# EAGLE design untitled (EAGLE 9.6.2)
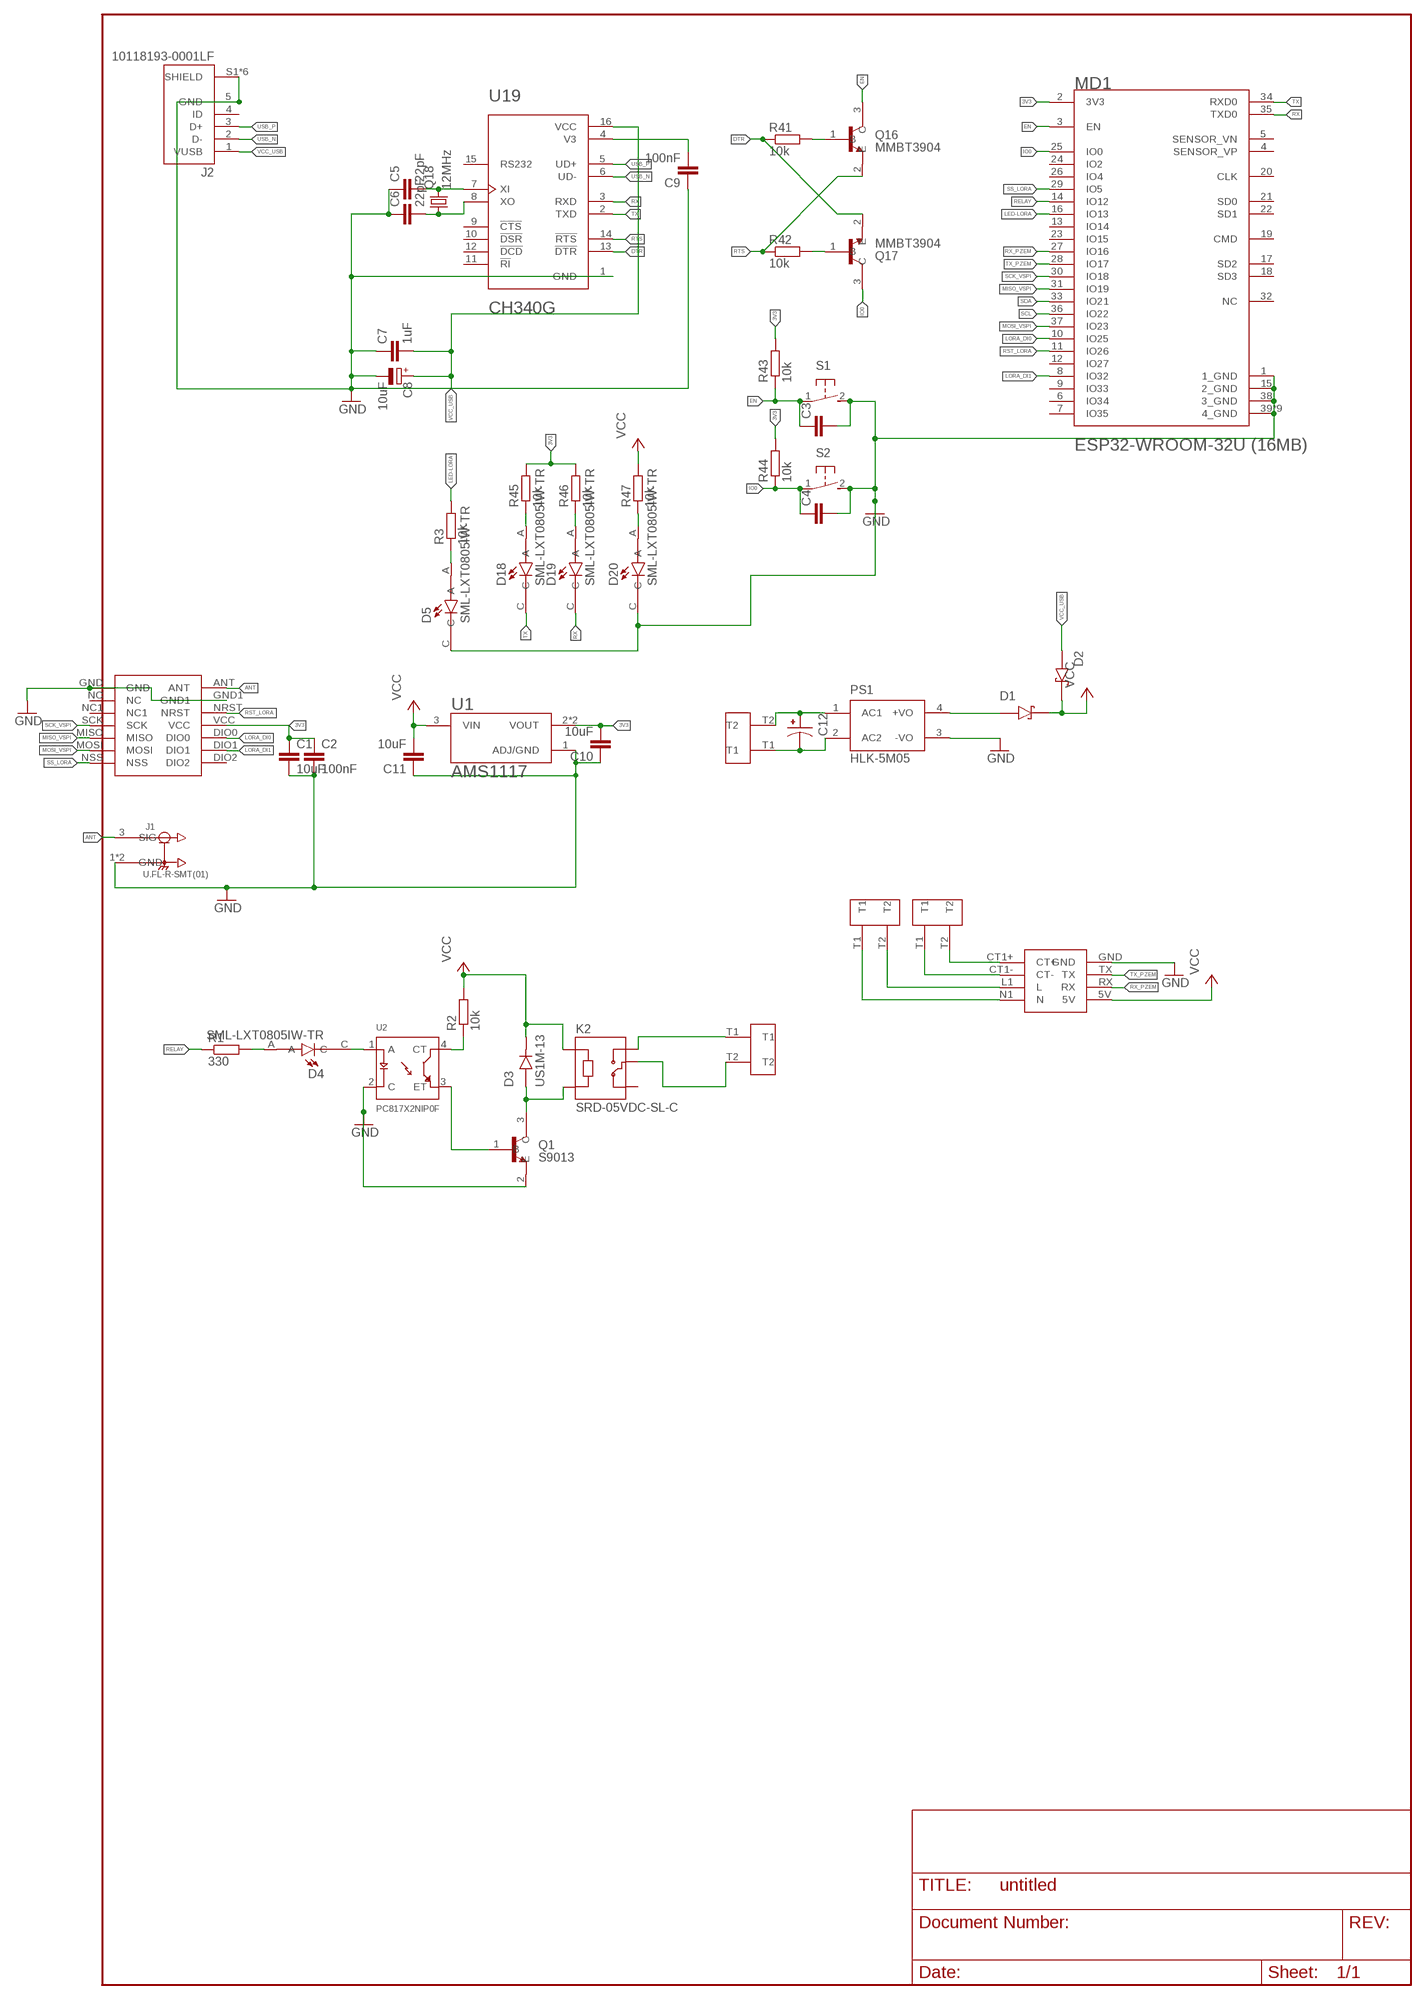
[diagram p0: schematic, sheet 1]

## Parts
C1  10uF  C-EUC0805K  [C0805K]
C2  100nF  C-EUC0805K  [C0805K]
C3  C-EUC0805K  [C0805K]
C4  C-EUC0805K  [C0805K]
C5  22pF  C-EUC0805K  [C0805K]
C6  22pF  C-EUC0805K  [C0805K]
C7  1uF  C-EUC0805K  [C0805K]
C8  10uF  CPOL-EU153CLV-0505  [153CLV-0505]
C9  100nF  C-EUC0805K  [C0805K]
C10  10uF  C-EUC0805K  [C0805K]
C11  10uF  C-EUC0805K  [C0805K]
C12  UPM2E100MHD1TO  [CAPPRD500W60D1250H2200]
D1  1N5819HW-7  [SOD3715X145N]
D2  1N5819HW-7  [SOD3715X145N]
D3  US1M-13  [DIOM5226X240N]
D4  SML-LXT0805IW-TR  [LEDC2012X120N]
D5  SML-LXT0805IW-TR  [LEDC2012X120N]
D18  SML-LXT0805IW-TR  [LEDC2012X120N]
D19  SML-LXT0805IW-TR  [LEDC2012X120N]
D20  SML-LXT0805IW-TR  [LEDC2012X120N]
J1  U.FL-R-SMT(01)  [HRS_U.FL-R-SMT(01)]
J2  10118193-0001LF  [FCI_10118193-0001LF]
K2  SRD-05VDC-SL-C  [RELAY_SRD-05VDC-SL-C]
LORA-NICERF-V1  LORA-NICERF-V2  [LORA-NICERF-V2]
MD1  ESPRESSIF_SYSTEMS_ESP32-WROOM-32U_16MBESPRESSIF_SYSTEMS_ESP32-WROOM-32U_16MB_0_0  [ESPRESSIF_SYSTEMS_ESP32-WROOM-32U_16MB_0]
PS1  HLK-5M05  [CONV_HLK-5M05]
PZEM004T1  PZEM004T  [PZEM004T]
Q1  S9013  [SOT95P240X120-3N]
Q16  MMBT3904  [SOT95P240X120-3N]
Q17  MMBT3904  [SOT95P240X120-3N]
Q18  12MHz  CRYSTALSM49  [SM49]
R1  330  R-EU_R0805  [R0805]
R2  10k  R-EU_R0805  [R0805]
R3  10k  R-EU_R0805  [R0805]
R41  10k  R-EU_R0805  [R0805]
R42  10k  R-EU_R0805  [R0805]
R43  10k  R-EU_R0805  [R0805]
R44  10k  R-EU_R0805  [R0805]
R45  10k  R-EU_R0805  [R0805]
R46  10k  R-EU_R0805  [R0805]
R47  10k  R-EU_R0805  [R0805]
S1  31-XX  [B3F-31XX]
S2  31-XX  [B3F-31XX]
TB7.1  TB7.62  [TB7.62]
TB7.2  TB7.62  [TB7.62]
TB7.3  TB7.62  [TB7.62]
TB7.4  TB7.62  [TB7.62]
U1  AMS1117  [SOT229P700X180-4N]
U2  PC817X2NIP0F  [SOT254P975X400-4N]
U19  CH340G  [SOIC127P600X180-16N]

## Nets
3V3: C1.1 C2.1 C10.2 LORA-NICERF-V1.VCC MD1.2(3V3) R43.2 R44.2 R45.2 R46.2 U1.2(VOUT) U1.4(VOUT)
ANT: J1.3(SIG) LORA-NICERF-V1.ANT
DTR: Q17.2(E) R41.1 U19.13(!DTR)
EN: C3.1 MD1.3(EN) Q16.3(C) R43.1 S1.1(P)
GND: C1.2 C2.2 C3.2 C4.2 C5.1 C6.1 C7.1 C8.- C9.1 C10.1 C11.1 D5.C D20.C J1.1(GND) J1.2(GND) J2.5(GND) J2.S1(SHIELD) J2.S2(SHIELD) J2.S3(SHIELD) J2.S4(SHIELD) J2.S5(SHIELD) J2.S6(SHIELD) LORA-NICERF-V1.GND LORA-NICERF-V1.GND1 MD1.1(1_GND) MD1.15(2_GND) MD1.38(3_GND) MD1.39(4_GND) MD1.39-2(4_GND) MD1.39-3(4_GND) MD1.39-4(4_GND) MD1.39-5(4_GND) MD1.39-6(4_GND) MD1.39-7(4_GND) MD1.39-8(4_GND) MD1.39-9(4_GND) PS1.3(-VO) PZEM004T1.GND Q1.2(E) S1.2(S) S2.2(S) U1.1(ADJ/GND) U2.2(C) U19.1(GND)
IO0: C4.1 MD1.25(IO0) Q17.3(C) R44.1 S2.1(P)
LED-LORA: MD1.16(IO13) R3.2
LORA_DI0: LORA-NICERF-V1.DIO0 MD1.10(IO25)
LORA_DI1: LORA-NICERF-V1.DIO1 MD1.8(IO32)
MISO_VSPI: LORA-NICERF-V1.MISO MD1.31(IO19)
MOSI_VSPI: LORA-NICERF-V1.MOSI MD1.37(IO23)
N$1: C12.P PS1.1(AC1) TB7.1.T2
N$2: C12.N PS1.2(AC2) TB7.1.T1
N$3: D1.A PS1.4(+VO)
N$4: D4.C U2.1(A)
N$5: R2.1 U2.4(CT)
N$6: Q1.1(B) U2.3(ET)
N$7: D3.A K2.A2 Q1.3(C)
N$8: D4.A R1.2
N$9: K2.COM TB7.2.T2
N$10: K2.NO TB7.2.T1
N$11: Q17.1(B) R42.2
N$12: D5.A R3.1
N$15: PZEM004T1.CT1+(CT+) TB7.3.T2
N$16: PZEM004T1.CT1-(CT-) TB7.3.T1
N$17: PZEM004T1.L1(L) TB7.4.T2
N$18: PZEM004T1.N1(N) TB7.4.T1
N$99: Q16.1(B) R41.2
N$102: C5.2 Q18.2 U19.7(XI)
N$103: C6.2 Q18.1 U19.8(XO)
N$104: C9.2 U19.4(V3)
N$105: D18.A R45.1
N$106: D19.A R46.1
N$107: D20.A R47.1
RELAY: MD1.14(IO12) R1.1
RST_LORA: LORA-NICERF-V1.NRST MD1.11(IO26)
RTS: Q16.2(E) R42.1 U19.14(!RTS)
RX: D19.C MD1.35(TXD0) U19.3(RXD)
RX_PZEM: MD1.27(IO16) PZEM004T1.RX
SCK_VSPI: LORA-NICERF-V1.SCK MD1.30(IO18)
SCL: MD1.36(IO22)
SDA: MD1.33(IO21)
SS_LORA: LORA-NICERF-V1.NSS MD1.29(IO5)
TX: D18.C MD1.34(RXD0) U19.2(TXD)
TX_PZEM: MD1.28(IO17) PZEM004T1.TX
USB_N: J2.2(D-) U19.6(UD-)
USB_P: J2.3(D+) U19.5(UD+)
VCC: C11.2 D1.C(K) D2.C(K) D3.C(K) K2.A1 PZEM004T1.5V R2.2 R47.2 U1.3(VIN)
VCC_USB: C7.2 C8.+ D2.A J2.1(VUSB) U19.16(VCC)
Unconnected: J2.4(ID) K2.NC LORA-NICERF-V1.DIO2 LORA-NICERF-V1.NC LORA-NICERF-V1.NC1 MD1.4(SENSOR_VP) MD1.5(SENSOR_VN) MD1.6(IO34) MD1.7(IO35) MD1.9(IO33) MD1.12(IO27) MD1.13(IO14) MD1.17(SD2) MD1.18(SD3) MD1.19(CMD) MD1.20(CLK) MD1.21(SD0) MD1.22(SD1) MD1.23(IO15) MD1.24(IO2) MD1.26(IO4) MD1.32(NC) U19.9(!CTS) U19.10(!DSR) U19.11(!RI) U19.12(!DCD) U19.15(RS232)

## Library data of the parts
C1-C7 C9-C11 = rcl:C-EU: CAPACITOR, European symbol; SPICEPREFIX: C
C8 = rcl:CPOL-EU: POLARIZED CAPACITOR, European symbol; SPICEPREFIX: C
C12 = UPM2E100MHD1TO:UPM2E100MHD1TO: CAP ALUM 10UF 20% 250V RADIAL Check availability <https://pricing.snapeda.com/parts/UPM2E100MHD1TO/Nichicon/view-part?ref=eda>; AVAILABILITY: In Stock; DESCRIPTION: 10 µF 250 V Aluminum Electrolytic Capacitors Radial, Can - 5000 Hrs @ 105°C; MF: Nichicon; MP: UPM2E100MHD1TO; PACKAGE: Radial Nichicon; PRICE: None; PURCHASE-URL: https://pricing.snapeda.com/search/part/UPM2E100MHD1TO/?ref=eda
D1 D2 = 1N5819HW-7:1N5819HW-7: 1N5819HW Series 40 V 1 A Surface Mount Schottky Barrier Rectifier - SOD-123 Check availability <https://pricing.snapeda.com/parts/1N5819HW-7/Diodes%20Inc./view-part?ref=eda>; AVAILABILITY: In Stock; DESCRIPTION: Diode Schottky 40 V 1A Surface Mount SOD-123; MF: Diodes Inc.; MP: 1N5819HW-7; PACKAGE: SOD-123 Fairchild Semiconductor; PRICE: None; PURCHASE-URL: https://pricing.snapeda.com/search/part/1N5819HW-7/?ref=eda
D3 = US1M-13:US1M-13: Diode, Fast Recovery, 1a, 1kv, Do-214ac-2, Full Reel Check availability <https://pricing.snapeda.com/parts/US1M-13/Diodes%20Incorporated/view-part?ref=eda>; AVAILABILITY: In Stock; DESCRIPTION: Diode Standard 1000 V 1A Surface Mount SMA; MF: Diodes Incorporated; MP: US1M-13; PACKAGE: DO-214AC-214 Diodes Incorporated; PRICE: None; PURCHASE-URL: https://pricing.snapeda.com/search/part/US1M-13/?ref=eda
D4 D5 D18-D20 = SML-LXT0805IW-TR:SML-LXT0805IW-TR: LED; Luminous Intensity:11µcd; Viewing Angle:140°; Forward Current:30mA; Forward Voltage:2V; Color:Red; LED Color:Red; Leaded Process Compatible:Yes; Lens Color:White; Mounting Type:Surface Mount ;RoHS Compliant: Yes Check availability <https://pricing.snapeda.com/parts/SML-LXT0805IW-TR/Lumex%20Opto/Components/view-part?ref=eda>; AVAILABILITY: In Stock; DESCRIPTION: Red - LED Indication - Discrete 2V 0805 (2012 Metric); MF: Lumex Opto/Components; MP: SML-LXT0805IW-TR; PACKAGE: 0805 Lumex; PRICE: None; PURCHASE-URL: https://pricing.snapeda.com/search/part/SML-LXT0805IW-TR/?ref=eda
J1 = U.FL-R-SMT_01_:U.FL-R-SMT(01): U.FL Series 6 Ghz 50 Ohm Ultra-small SMT Coaxial Cable Receptacle Check availability <https://pricing.snapeda.com/parts/U.FL-R-SMT%2801%29/Hirose/view-part?ref=eda>; AVAILABILITY: In Stock; DESCRIPTION: U.FL (UMCC) Connector Receptacle, Male Pin 50Ohm Surface Mount Solder. RF Connectors / Coaxial Connectors; MF: Hirose; MP: U.FL-R-SMT(01); PACKAGE: None; PRICE: None; PURCHASE-URL: https://pricing.snapeda.com/search/part/U.FL-R-SMT(01)/?ref=eda
J2 = 10118193-0001LF:10118193-0001LF: Micro USB B Type Receptacle Check availability <https://pricing.snapeda.com/parts/10118193-0001LF/FCI/view-part?ref=eda>; AVAILABILITY: In Stock; DESCRIPTION: USB - micro B USB 2.0 Receptacle Connector 5 Position Surface Mount, Right Angle; Through Hole; MF: FCI; MP: 10118193-0001LF; PACKAGE: None; PRICE: None; PURCHASE-URL: https://pricing.snapeda.com/search/part/10118193-0001LF/?ref=eda
K2 = SRD-05VDC-SL-C:SRD-05VDC-SL-C: 5V Trigger Relay Module For Arduino And Raspberry Pi 5V Trigger Relay Module For Arduino And Raspberry Pi Check availability <https://pricing.snapeda.com/parts/SRD-05VDC-SL-C/Songle%20Relay/view-part?ref=eda>; AVAILABILITY: Not in stock; DESCRIPTION: 5V Trigger Relay Module For Arduino And Raspberry Pi 5V Trigger Relay Module For Arduino And Raspberry Pi; MF: Songle Relay; MP: SRD-05VDC-SL-C; PACKAGE: NON STANDARD-5 Songle Relay; PRICE: None
LORA-NICERF-V1 = LORA-NICERF-V2:LORA-NICERF-V2
MD1 = Espressif Systems - ESP32-WROOM-32U (16MB):ESPRESSIF_SYSTEMS_ESP32-WROOM-32U_16MB: Bluetooth, WiFi 802.11b/g/n, Bluetooth v4.2 +EDR, Class 1, 2 and 3 Transceiver Module 2.4GHz ~ 2.5GHz Antenna Not Included, U.FL Surface Mount; AUTOMOTIVE: No; BANDWIDTH: 72MHz; CENTROID_NOT_SPECIFIED: No; DATASHEET: https://www.espressif.com/sites/default/files/documentation/esp32-wroom-32d_esp32-wroom-32u_datasheet_en.pdf; DATA_RATE: 150Mbits/s; DEVICE_CLASS_L1: Integrated Circuits (ICs); DEVICE_CLASS_L2: RF Semiconductors and Devices; DEVICE_CLASS_L3: Transceivers; DIGIKEY_DESCRIPTION: RX TXRX MODULE WIFI U.FL SMD; DIGIKEY_PART_NUMBER: 1904-1028-1-ND; FOOTPRINT_VARIANT_NAME_0: Recommended_Land_Pattern; HEIGHT: 3.35mm; INTERFACE: I2C,SPI,UART,Ethernet,I2S,Other; LEAD_FREE: Yes; MAX_FREQUENCY: 2484MHz; MAX_SUPPLY_VOLTAGE: 3.6V; MF: Espressif Systems; MFG_PACKAGE_IDENT: 0; MFG_PACKAGE_IDENT_DATE: 0; MFG_PACKAGE_IDENT_REV: 0; MIN_SUPPLY_VOLTAGE: 3V; MOUSER_PART_NUMBER: 356-ES32WROOM32U16MB; MPN: ESP32-WROOM-32U (16MB); NOMINAL_SUPPLY_CURRENT: 0.5A; NUMBER_OF_ADC_CHANNELS: 16; NUMBER_OF_GPIO: 26; PACKAGE: BT_MODULE; PREFIX: MD; ROHS: Yes; SENSITIVITY: -98dBm; TEMPERATURE_RANGE_HIGH: +85°C; TEMPERATURE_RANGE_LOW: -40°C; VERIFICATION_VERSION: 0.0.0.3
PS1 = HLK-5M05:HLK-5M05: AC DC 220V to 5V 5W 5Watt Isolated Switching Step-Down Power Supply Module Converter Check availability <https://pricing.snapeda.com/parts/HLK-5M05/Hi-link/view-part?ref=eda>; AVAILABILITY: Not in stock; MF: Hi-link; MP: HLK-5M05; PACKAGE: Package; PRICE: None
PZEM004T1 = PZEM004T:PZEM004T
Q1 = S9013:S9013: SMD Transistors NPN 25V-500mA Check availability <https://pricing.snapeda.com/parts/S9013/JCET/view-part?ref=eda>; AVAILABILITY: In Stock; DESCRIPTION: Bipolar (BJT) Transistor NPN 20V 500mA 625mW Through Hole TO-92-3; MF: JCET; MP: S9013; PACKAGE: SOT-23-3 JCET; PRICE: None; PURCHASE-URL: https://pricing.snapeda.com/search/part/S9013/?ref=eda
Q16 Q17 = MMBT3904:MMBT3904: MMBT3904 Series 40 V CE Breakdown 0.2 A NPN General Purpose Amplifier - SOT-23 Check availability <https://pricing.snapeda.com/parts/MMBT3904/ON%20Semiconductor/view-part?ref=eda>; AVAILABILITY: In Stock; DESCRIPTION: Bipolar (BJT) Transistor NPN 40 V 200 mA 300MHz 300 mW Surface Mount SOT-23-3 (TO-236); MF: ON Semiconductor; MP: MMBT3904; PACKAGE: SOT-23-3 Motorola; PRICE: None
Q18 = crystal:CRYSTAL: CRYSTAL; OC_FARNELL: unknown; OC_NEWARK: unknown
R1-R3 R41-R47 = rcl:R-EU_: RESISTOR, European symbol; SPICEPREFIX: R
S1 S2 = switch-omron:31-XX: OMRON SWITCH; MPN: B3F-3100; OC_FARNELL: 959704; OC_NEWARK: 36M3582
TB7.1-TB7.4 = TB7.62:TB7.62
U1 = AMS1117:AMS1117: Sot223/Pkg 1-Amp 5-Volt Low Drop Out Voltage Regulatator Check availability <https://pricing.snapeda.com/parts/AMS1117/Advanced%20Monolithic%20Systems/view-part?ref=eda>; AVAILABILITY: Not in stock; DESCRIPTION: 1A LOW DROPOUT VOLTAGE REGULATOR SOT-223; MF: Advanced Monolithic Systems; MP: AMS1117; PACKAGE: SOT-223 Seeed Technology; PRICE: None
U2 = PC817X2NIP0F:PC817X2NIP0F: PC817 Series 1 Channel 80 V 5000 Vrms General Purpose Photocoupler - DIP-4 Check availability <https://pricing.snapeda.com/parts/PC817X2NIP0F/Sharp%20Microelectronics/view-part?ref=eda>; AVAILABILITY: Not in stock; DESCRIPTION: Optoisolator Transistor Output 5000Vrms 1 Channel 4-SMD; MF: Sharp Microelectronics; MP: PC817X2NIP0F; PACKAGE: SMD-4 Sharp Microelectronics; PRICE: None
U19 = CH340G:CH340G: Check availability <https://pricing.snapeda.com/parts/Ch340G/WCH/view-part?ref=eda>; AVAILABILITY: Not in stock; DESCRIPTION: USB Interface Integrated Circuit; MF: WCH; MP: Ch340G; PACKAGE: None; PRICE: None

## Board
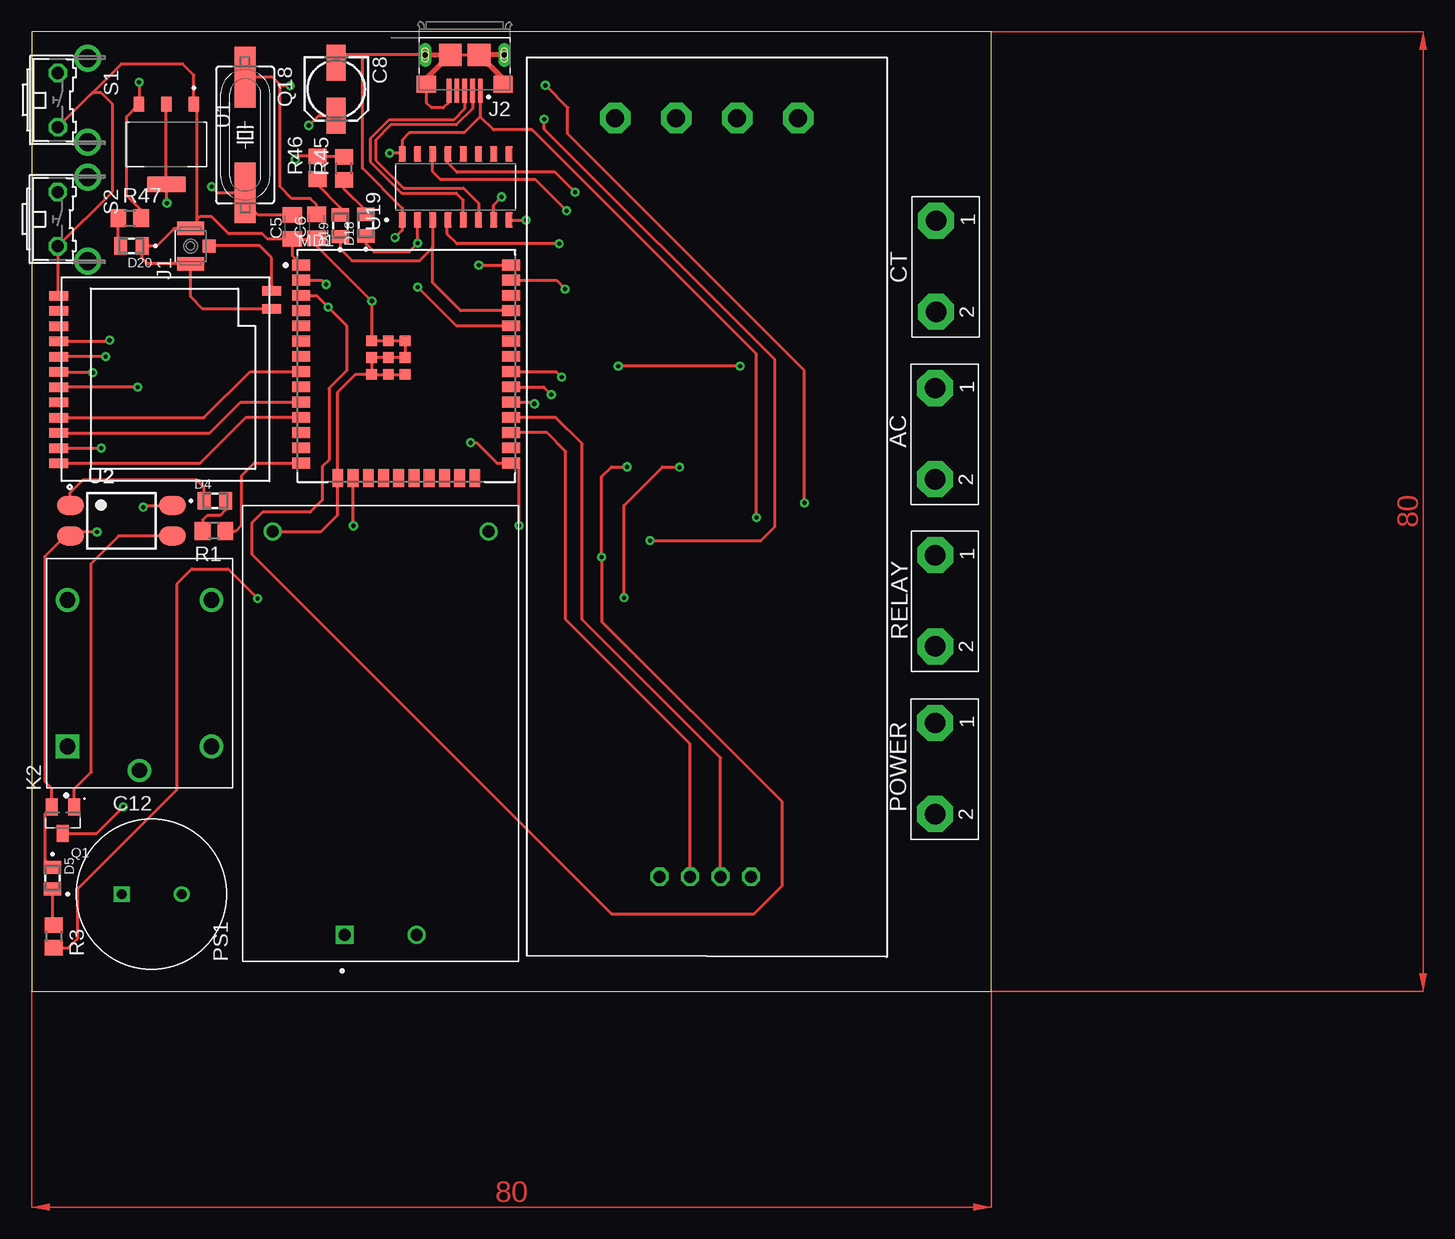
[diagram p1: board, top side]
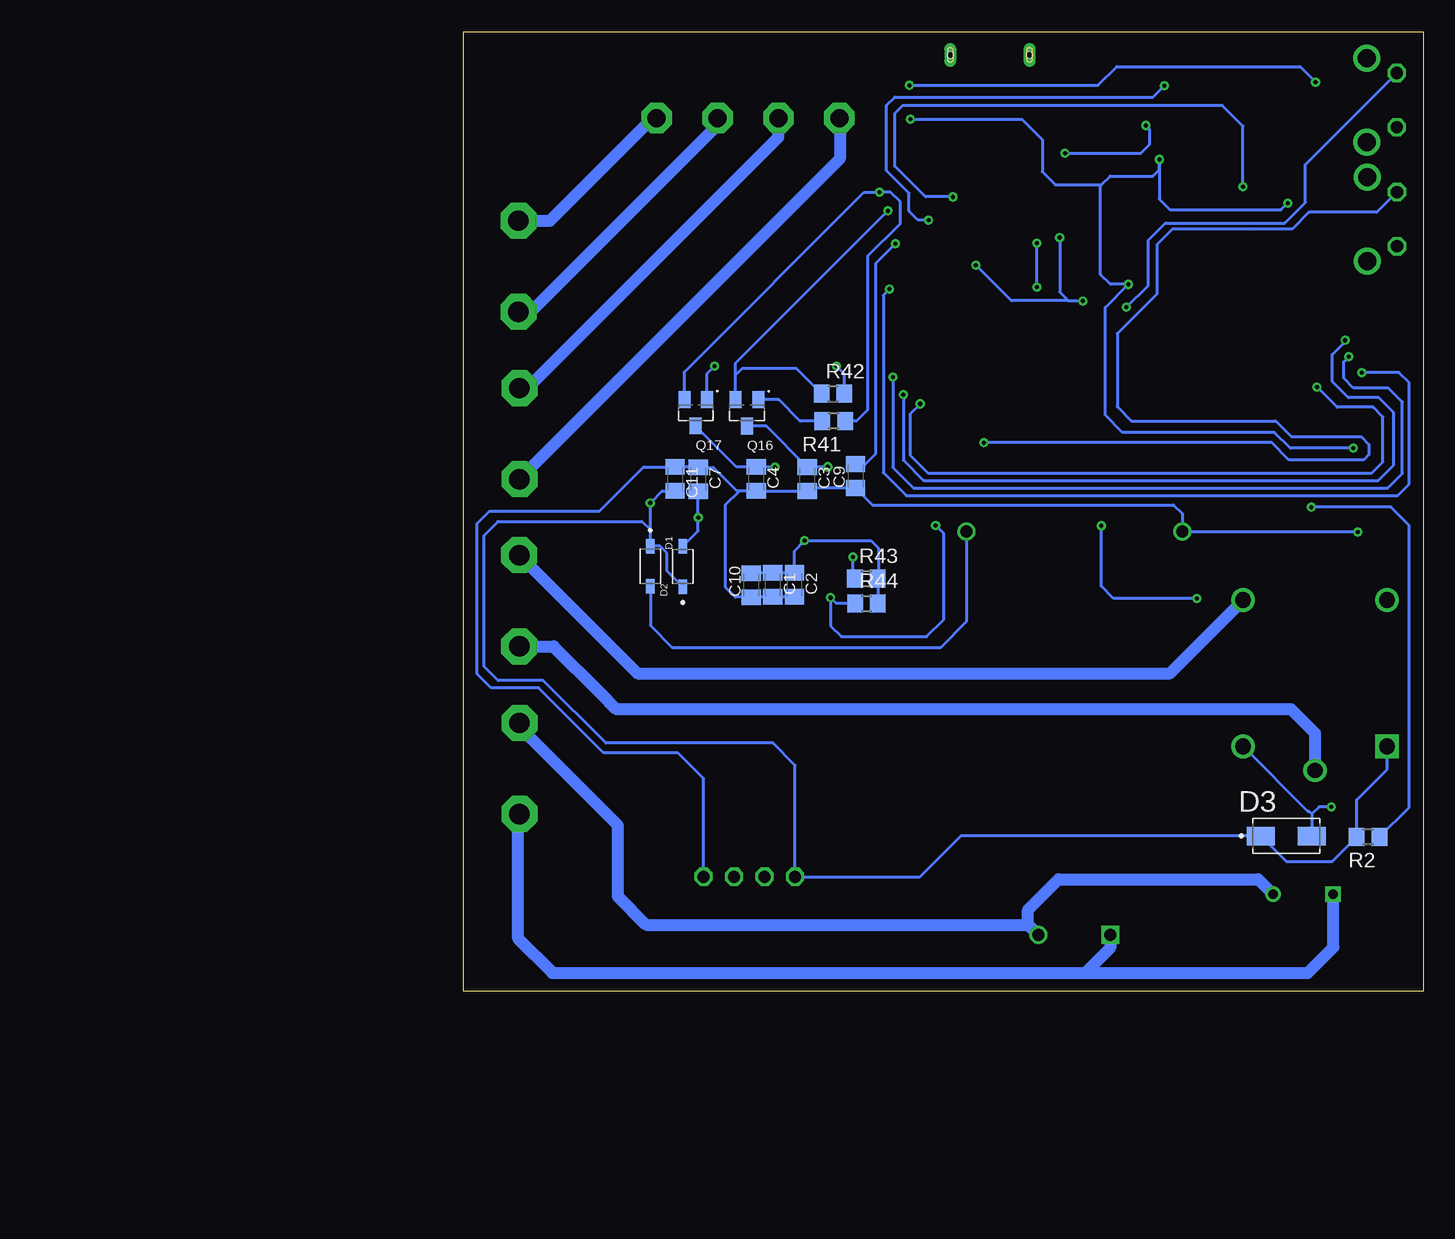
[diagram p2: board, bottom side, seen from below]

Size 80 x 80 mm. Coordinates in mm from the lower left corner, seen from the top.
Outline: 0,80 0,0 80,0 80,80 0,80
Copper layers (1*16): Top 0.035mm / dielectric 1.5mm / Bottom 0.035mm
Design rules "default": minimum track width 6mil, minimum drill 0.35mm, track to track 6mil, track to pad 6mil, pad to pad 6mil, via to via 6mil, smd to smd 6mil, copper to edge 40mil, drill to drill 6mil, minimum pad ring 10mil, minimum via ring 8mil, stop-mask expansion 4mil, vias tented up to drill 0mil, thermal gap 10mil

### Footprints (pad centres in the part's own frame; a part is rotated, then mirrored left to right if it is on the bottom)
C0805K = smd 1.3 x 1.6: 1 -1,0; 2 1,0
153CLV-0505 = smd 3 x 1.6: + 2.2,0; - -2.2,0
CAPPRD500W60D1250H2200 = drill 0.8 pad 1.15: N 2.5,0 | drill 0.8 pad 1.15 square: P -2.5,0
SOD3715X145N = smd 1.21 x 0.73: A 1.68,0; C -1.68,0
DIOM5226X240N = smd 2.33 x 1.55: A 2.135,0; C -2.135,0
LEDC2012X120N = smd 1.1 x 1.45: A 0.9,0; C -0.9,0
HRS_U.FL-R-SMT(01) = smd 1.1 x 2.25: 1 -1.475,0; 2 1.475,0 | smd 1.05 x 1.1: 3 0,-1.55
FCI_10118193-0001LF = smd 0.4 x 2: 1 -1.3,2.975; 2 -0.65,2.975; 3 0,2.975; 4 0.65,2.975; 5 1.3,2.975 | smd 1.6 x 1.4: S1 -3.2,2.45; S2 3.2,2.45 | smd 1.9 x 1.9: S3 1.2,0; S4 -1.2,0 | drill 0.5 pad 0.9 long: S5 -3.3,0; S6 3.3,0 | hole 0.5: -3.3,0; 3.3,0
RELAY_SRD-05VDC-SL-C = drill 1.32 square: A1 -6.1,6 | drill 1.32: A2 -6.1,-6; NC 6.1,6; NO 6.1,-6 | drill 1.29: COM -8.1,0
LORA-NICERF-V2 = smd 1.6 x 0.8: ANT 9.17,6.81; DIO0 -8.57,-5.03; DIO1 -8.57,-3.76; DIO2 -8.57,-2.49; GND -8.57,6.4; GND1 9.17,5.31; MISO -8.57,1.32; MOSI -8.57,0.05; NC -8.57,5.13; NC1 -8.57,3.86; NRST -8.57,-7.57; NSS -8.57,-1.22; SCK -8.57,2.59; VCC -8.57,-6.3
ESPRESSIF_SYSTEMS_ESP32-WROOM-32U_16MB_0 = smd 1.5 x 0.9: 1 -8.75,8.41; 2 -8.75,7.14; 3 -8.75,5.87; 4 -8.75,4.6; 5 -8.75,3.33; 6 -8.75,2.06; 7 -8.75,0.79; 8 -8.75,-0.48; 9 -8.75,-1.75; 10 -8.75,-3.02; 11 -8.75,-4.29; 12 -8.75,-5.56; 13 -8.75,-6.83; 14 -8.75,-8.1; 25 8.75,-8.1; 26 8.75,-6.83; 27 8.75,-5.56; 28 8.75,-4.29; 29 8.75,-3.02; 30 8.75,-1.75; 31 8.75,-0.48; 32 8.75,0.79; 33 8.75,2.06; 34 8.75,3.33; 35 8.75,4.6; 36 8.75,5.87; 37 8.75,7.14; 38 8.75,8.41 | smd 0.9 x 1.5: 15 -5.71,-9.35; 16 -4.44,-9.35; 17 -3.17,-9.35; 18 -1.9,-9.35; 19 -0.63,-9.35; 20 0.64,-9.35; 21 1.91,-9.35; 22 3.18,-9.35; 23 4.45,-9.35; 24 5.72,-9.35 | smd 0.9 x 0.9: 39 -2.9,2.09; 39-2 -1.5,0.69; 39-3 -1.5,2.09; 39-4 -0.1,2.09; 39-5 -0.1,-0.71; 39-6 -1.5,-0.71; 39-7 -2.9,-0.71; 39-8 -0.1,0.69; 39-9 -2.9,0.69
CONV_HLK-5M05 = drill 1 pad 1.5 square: 1 -16.8,3 | drill 1 pad 1.5: 2 -16.8,-3; 3 16.8,9; 4 16.8,-9
PZEM004T = drill 1 octagon: 5V 3.7,-10.06; GND 3.7,-17.68; RX 3.7,-12.6; TX 3.7,-15.14 | drill 1.5 pad 2.54 octagon: CT1+ 66.94,-6.36; CT1- 66.94,-11.44; L1 66.94,-16.52; N1 66.94,-21.6
SOT95P240X120-3N = smd 1 x 1.4: 1 -0.95,-1.1; 2 0.95,-1.1; 3 0,1.1
SM49 = smd 5.08 x 1.778: 1 -4.826,0; 2 4.826,0
R0805 = smd 1.3 x 1.5: 1 -0.95,0; 2 0.95,0
B3F-31XX = drill 1.016 octagon: 1 -2.261,-1.245; 2 2.261,-1.245 | drill 1.499 pad 2.159: 3 -3.505,1.245; 4 3.505,1.245
TB7.62 = drill 1.7 pad 3 octagon: T1 -3.7,-0.6; T2 3.9,-0.6
SOT229P700X180-4N = smd 1.31 x 0.93: 1 -3.345,2.29; 2 -3.345,0; 3 -3.345,-2.29 | smd 1.31 x 3.24: 4 3.345,0
SOT254P975X400-4N = smd 2.25 x 1.6: 1 -4.25,1.27; 2 -4.25,-1.27; 3 4.25,-1.27; 4 4.25,1.27
SOIC127P600X180-16N = smd 1.31 x 0.62: 1 -2.75,4.445; 2 -2.75,3.175; 3 -2.75,1.905; 4 -2.75,0.635; 5 -2.75,-0.635; 6 -2.75,-1.905; 7 -2.75,-3.175; 8 -2.75,-4.445; 9 2.75,-4.445; 10 2.75,-3.175; 11 2.75,-1.905; 12 2.75,-0.635; 13 2.75,0.635; 14 2.75,1.905; 15 2.75,3.175; 16 2.75,4.445

### Placement (x,y rotation side)
C1  54.22,33.87 270 bottom
C2  52.4,33.87 270 bottom
C3  51.34,42.69 270 bottom
C4  55.58,42.71 270 bottom
C5  21.75,63.71 90 top
C6  23.76,63.77 90 top
C7  60.42,42.69 270 bottom
C8  25.4,75.2 270 top
C9  47.31,42.94 90 bottom
C10  56,33.85 90 bottom
C11  62.35,42.71 270 bottom
C12  10.01,8.1 0 top
D1  64.42,35.42 270 bottom
D2  61.72,35.39 90 bottom
D3  11.4,12.94 0 bottom
D4  15.29,40.88 0 top
D5  1.75,9.42 270 top
D18  27.87,63.86 90 top
D19  25.74,63.81 90 top
D20  8.33,62.13 180 top
J1  13.27,62.11 90 top
J2  36.11,78.05 180 top
K2  9,26.5 90 top
LORA-NICERF-V1  10.84,51.57 0 top
MD1  31.24,52.13 0 top
PS1  29.08,21.5 90 top
PZEM004T1  42.29,5.84 90 top
Q1  2.62,14.25 180 top
Q16  56.35,48.21 180 bottom
Q17  60.64,48.22 180 bottom
Q18  17.8,71.37 270 top
R1  15.21,38.37 180 top
R2  4.59,12.85 180 bottom
R3  1.85,4.57 270 top
R41  49.13,47.52 180 bottom
R42  49.19,49.8 0 bottom
R43  46.41,34.4 0 bottom
R44  46.4,32.32 0 bottom
R45  26.04,68.58 90 top
R46  23.85,68.64 90 top
R47  8.19,64.44 0 top
S1  3.44,74.28 270 top
S2  3.42,64.36 270 top
TB7.1  75.92,18.66 270 top
TB7.2  75.94,32.65 270 top
TB7.3  75.93,46.58 270 top
TB7.4  76.01,60.53 270 top
U1  11.24,70.6 270 top
U2  7.49,39.22 0 top
U19  35.35,67.04 90 top

### Tracks (layer width: path | path; a pad name or v marks a point on that pad's centre or on a via)
3V3  (via drill 0.35)
  Top 0.254: 23.83,69.57 R46.2 | R46.2 23.93,69.67 | R46.2 25.99,69.59 R45.2 | U1.2 U1.4 11.29,67.21 v11.29,65.7 | R46.2 22.24,69.59 v21.99,69.34 | MD1.2 24.22,59.27 v24.56,58.92 | LORA-NICERF-V1.VCC v5.82,45.27 | v51.55,37.56 60.79,37.56 61.96,38.73 61.96,52.66 42.74,71.88 v42.74,72.69
  Bottom 0.254: C10.2 55.99,34.87 C1.1 C2.1 52.4,36.71 v51.55,37.56 46.04,37.56 45.41,36.93 45.41,34.44 R43.2 45.46,32.33 R44.2 | v11.29,65.7 11.84,65.14 21.09,65.14 21.99,66.04 v21.99,69.34 21.99,68.49 22.54,67.95 26.07,67.95 26.8,67.22 | 26.8,67.22 26.89,67.14 26.89,59.76 26.05,58.92 v24.56,58.92 26.49,57 26.49,48.03 25.05,46.59 12.38,46.59 11.07,45.27 v5.82,45.27 | v42.74,72.69 33.43,72.69 31.74,71 31.74,68.3 30.66,67.22 26.8,67.22
ANT
  Top 0.254: LORA-NICERF-V1.ANT 20.01,61.13 19,62.14 14.85,62.14 J1.3
DTR  (via drill 0.35)
  Top 0.254: v45.31,66.61 43.65,68.27 35.47,68.27 34.67,69.06 34.67,69.75 U19.13
  Bottom 0.254: Q17.2 61.59,51.62 46.6,66.61 v45.31,66.61 44.39,66.61 43.58,65.8 43.58,63.98 46.3,61.26 46.3,48.46 47.24,47.52 R41.1
EN  (via drill 0.35)
  Top 0.254: v49.63,43.71 48.35,43.71 47.52,42.88 v47.52,36.19 47.52,30.82 62.58,15.76 62.58,8.8 60.23,6.44 48.35,6.44 18.37,36.43 18.37,39.04 19.25,39.92 23.24,39.92 24.25,40.93 24.25,43.74 24.79,44.3 24.79,50.27 26.25,51.73 26.25,55.49 v24.73,57.01 23.75,58 MD1.3
  Bottom 0.254: Q16.3 54.75,47.11 C3.1 51.32,43.71 v49.63,43.71 | R43.1 47.52,34.56 v47.52,36.19 | v24.73,57.01 22.91,58.84 22.91,62.6 21.47,64.03 11.54,64.03 9.82,65.75 9.82,68.92 S1.1
GND  (via drill 0.35)
  Top 0.254: J2.5 34.81,74.13 34.32,73.64 33.36,73.64 32.91,74.08 J2.S2 | J2.S6 27.35,78.05 | 27.35,78.05 26.05,78.05 C8.- | C5.1 23.2,62.71 | 23.2,62.71 23.71,62.71 C6.1 | MD1.1 21.75,61.28 C5.1 | MD1.39-7 MD1.39-9 MD1.39-2 MD1.39-8 MD1.39-4 MD1.39-3 MD1.39 28.37,54.25 v28.37,57.54 23.2,62.71 | MD1.39-7 MD1.39-6 MD1.39-5 | 27.35,78.05 27.59,77.81 27.59,68.6 30.9,65.29 U19.1 30.9,63.44 v30.29,62.83 | J1.1 | J1.1 9.7,60.63 9.23,61.11 D20.C 10.43,62.13 11.88,63.58 J1.2 13.8,64.12 13.8,64.36 | MD1.39-7 27.03,51.42 25.53,49.92 MD1.15 25.53,39.7 24.13,38.3 PS1.3 | 13.8,64.36 13.8,73.67 U1.1 13.53,76.37 12.61,77.28 7.46,77.28 S1.2 5.07,74.9 5.79,74.9 6.75,73.94 6.75,66.67 S2.2 2.18,58.06 LORA-NICERF-V1.GND | v37.29,60.53 MD1.38 | LORA-NICERF-V1.GND1 14.28,56.88 13.27,57.89 J1.1 | C5.1 19.66,62.71 19.23,63.15 16.44,63.15 15.01,64.58 14.02,64.58 13.8,64.36 | J2.S3 J2.S4 | v5.45,38.28 3.57,38.28 U2.2 2.98,37.69 2.54,37.69 1.14,36.29 1.14,17.44 1.67,16.92 Q1.2 1.14,14.82 1.14,10.93 D5.C
  Top 0.406: J2.S1 39.31,76.08 37.94,77.44 37.94,78.02 37.9,78.06 J2.S4 | J2.S4 | J2.S5 J2.S4 | J2.S4 | J2.S2 32.91,76.05 J2.S3 J2.S6
  Bottom 0.254: C2.2 C1.2 55.99,32.87 C10.1 57.33,32.85 58.14,33.66 58.14,40.58 57.01,41.71 | PZEM004T1.GND 59.98,17.72 62.12,19.87 68.31,19.87 73.73,25.29 77.69,25.29 78.86,26.46 78.86,39 77.84,40.02 68.66,40.02 64.98,43.7 C11.1 60.44,43.7 C7.1 60.39,43.66 59.16,43.66 57.21,41.71 57.01,41.71 | 57.01,41.71 C4.2 55.57,41.69 C3.2 51.09,41.94 C9.1 45.9,40.53 20.82,40.53 20.08,39.8 PS1.3 5.47,38.3 v5.45,38.28 | v30.29,62.83 30.29,58.29 29.57,57.57 | v28.37,57.54 28.4,57.57 29.57,57.57 | 29.57,57.57 34.31,57.57 37.28,60.53 v37.29,60.53
IO0  (via drill 0.35)
  Top 0.254: v49.39,32.8 49.39,40.48 52.6,43.69 54.01,43.69 v54.02,43.68 | v40.63,38.82 40.63,44.02 MD1.25 | MD1.25 | v36.61,45.72 37.1,45.72 38.8,44.02 MD1.25
  Bottom 0.254: Q17.3 57.22,43.71 C4.1 54.05,43.71 v54.02,43.68 | R44.1 48.91,32.32 v49.39,32.8 | v49.39,32.8 | v49.39,32.8 | v49.39,32.8 49.39,30.45 48.5,29.56 41.39,29.56 39.96,31 39.96,38.15 v40.63,38.82 | S2.1 3.86,64.94 9.51,64.94 10.92,63.53 20.9,63.53 22.19,62.24 22.19,58.13 25.49,54.83 25.49,48.71 24.32,47.54 12.29,47.54 10.98,46.23 5.16,46.23 4.51,45.59 4.51,44.72 4.95,44.29 11.18,44.29 12.6,45.72 v36.61,45.72
LED-LORA  (via drill 0.35)
  Top 0.254: R3.2 3.07,3.62 3.86,4.41 3.86,8.54 12.13,16.82 12.13,33.98 13.36,35.21 16.39,35.21 v18.85,32.74 | v26.83,38.8 26.8,38.82 MD1.16
  Bottom 0.254: v18.85,32.74 25.81,32.74 26.83,33.76 v26.83,38.8
LORA_DI0
  Top 0.254: LORA-NICERF-V1.DIO0 14.85,46.54 17.42,49.11 MD1.10
LORA_DI1
  Top 0.254: LORA-NICERF-V1.DIO1 14.37,47.81 18.21,51.65 MD1.8
MISO_VSPI  (via drill 0.35)
  Top 0.254: MD1.31 43.74,51.65 v44.2,51.18 | v6.19,52.9 LORA-NICERF-V1.MISO
  Bottom 0.254: v44.2,51.18 44.2,43.67 42.49,41.96 2.94,41.96 1.73,43.17 1.73,49.12 2.91,50.3 5.81,50.3 6.63,51.12 6.63,52.46 v6.19,52.9
MOSI_VSPI  (via drill 0.35)
  Top 0.254: MD1.37 43.75,59.27 v44.48,58.54 | v5.12,51.56 2.32,51.56 LORA-NICERF-V1.MOSI
  Bottom 0.254: v44.48,58.54 45,58.03 45,43.23 43.08,41.31 2.12,41.31 1.16,42.27 1.16,50.73 2.01,51.58 5.09,51.58 v5.12,51.56
N$1
  Bottom 1.016: PS1.1 26.08,3.61 28.17,1.52 | 28.17,1.52 72.59,1.52 75.44,4.37 75.44,14.65 TB7.1.T2 | 28.17,1.52 9.62,1.52 7.48,3.67 7.48,8.06 C12.P
N$2
  Bottom 1.016: 32.93,5.54 64.76,5.54 67.12,7.9 67.12,13.8 75.33,22.01 TB7.1.T1 | PS1.2 32.93,5.54 | 32.93,5.54 32.93,6.78 30.38,9.32 13.74,9.32 C12.N
N$3
  Bottom 0.254: D1.A 64.42,30.48 62.61,28.67 40.2,28.67 38.03,30.84 38.03,38.25 PS1.4
N$4
  Top 0.254: D4.C 14.39,42 13.77,42.62 4.27,42.62 3.19,41.55 3.19,40.53 U2.1
N$5  (via drill 0.35)
  Top 0.254: v9.3,40.34 9.45,40.49 U2.4
  Bottom 0.254: R2.1 1.16,15.33 1.16,38.83 2.69,40.36 9.29,40.36 v9.3,40.34
N$6
  Top 0.254: U2.3 7.25,37.95 4.98,35.67 4.98,18.27 3.57,16.86 Q1.1
N$7  (via drill 0.35)
  Top 0.254: Q1.3 5.44,13.15 v7.66,15.37
  Bottom 0.254: K2.A2 9.6,15 9.5,15 9.26,14.76 | 9.26,14.76 D3.A | v7.66,15.37 8.66,15.37 9.26,14.76
N$8
  Top 0.254: D4.A 16.19,40.13 15.73,39.67 14.66,39.67 14.26,39.28 R1.2
N$9
  Bottom 1.016: TB7.2.T2 72.48,28.75 68.61,24.89 67.22,23.5 11,23.5 9,21.5 K2.COM
N$10
  Bottom 1.016: TB7.2.T1 65.49,26.5 21.1,26.5 K2.NO
N$11  (via drill 0.35)
  Top 0.254: v59.07,52.11 48.94,52.11 48.92,52.09 v48.91,52.1
  Bottom 0.254: R42.2 48.24,51.43 v48.91,52.1 | Q17.1 59.69,51.49 v59.07,52.11
N$12
  Top 0.254: R3.1 1.75,5.62 D5.A
N$15
  Bottom 1.016: TB7.3.T2 48.62,69.38 48.62,72.75 PZEM004T1.CT1+
N$16
  Bottom 1.016: TB7.3.T1 74.63,50.28 53.73,71.17 PZEM004T1.CT1-
N$17
  Bottom 1.016: TB7.4.T2 74.37,56.63 58.81,72.19 PZEM004T1.L1
N$18
  Bottom 1.016: TB7.4.T1 72.79,64.23 64.24,72.78 PZEM004T1.N1
N$99
  Bottom 0.254: R41.2 51.92,47.52 53.71,49.31 Q16.1
N$102  (via drill 0.35)
  Top 0.254: C5.2 18.89,64.71 17.8,65.8 Q18.2 15.53,66.55 v15.01,67.07 | U19.7 38.52,65.54 v39.19,66.22
  Bottom 0.254: v39.19,66.22 41.48,66.22 44.03,68.76 44.03,73.18 43.39,73.82 16.72,73.82 15.01,72.11 v15.01,67.07
N$103  (via drill 0.35)
  Top 0.254: C6.2 23.77,65.56 23.24,66.09 21.69,66.09 20.73,67.05 20.73,75.55 | 20.73,75.55 20.73,75.56 20.09,76.21 Q18.1 | U19.8 41.21,64.29 v41.22,64.28 | v21.56,75.49 20.8,75.49 20.73,75.55
  Bottom 0.254: v41.22,64.28 42.1,64.28 42.85,65.04 42.85,66.53 44.72,68.41 44.72,73.84 44.03,74.54 22.51,74.54 v21.56,75.49
N$104  (via drill 0.35)
  Top 0.254: v43.99,62.31 35.47,62.31 34.65,63.13 34.65,64.23 U19.4
  Bottom 0.254: C9.2 46.5,43.94 45.63,44.81 45.63,60.68 v43.99,62.31
N$105
  Top 0.254: D18.A 27.87,65.05 26.04,66.88 R45.1
N$106
  Top 0.254: D19.A 25.73,65.33 23.85,67.22 R46.1
N$107
  Top 0.254: D20.A 7.24,62.31 R47.1
RELAY
  Top 0.254: R1.1 17.04,38.37 17.53,38.86 17.53,42.99 18.57,44.03 MD1.14
RST_LORA
  Top 0.254: MD1.11 17.87,47.84 14.03,44 LORA-NICERF-V1.NRST
RTS  (via drill 0.35)
  Top 0.254: v44.61,65.05 42,67.66 34.09,67.66 33.42,68.34 33.42,69.77 U19.14
  Bottom 0.254: Q16.2 57.3,51.37 | 57.3,51.37 57.3,52.37 v44.61,65.05 | R42.1 52.25,51.91 56.77,51.91 57.3,51.37
RX
  Top 0.254: D19.C 25.73,61.88 26.72,60.9 32.34,60.9 33.45,62.01 33.45,62.11 | 33.45,62.11 33.45,64.28 U19.3 | MD1.35 35.77,56.73 33.44,59.05 33.44,62.09 33.45,62.11
RX_PZEM
  Top 0.254: PZEM004T1.RX 54.9,20.61 44.54,30.97 44.54,45 42.96,46.57 MD1.27
SCK_VSPI  (via drill 0.35)
  Top 0.254: MD1.30 42.68,50.38 v43.33,49.73 | v6.5,54.26 6.4,54.16 LORA-NICERF-V1.SCK
  Bottom 0.254: v43.33,49.73 43.33,44.28 41.63,42.58 3.74,42.58 2.45,43.87 2.45,48.24 3.68,49.47 6.23,49.47 7.58,50.83 7.58,53.08 6.45,54.21 v6.5,54.26
SS_LORA  (via drill 0.35)
  Top 0.254: MD1.29 41.77,49.11 v41.92,48.96 | v8.85,50.35 LORA-NICERF-V1.NSS
  Bottom 0.254: v41.92,48.96 42.76,48.12 42.76,44.69 41.26,43.19 4.29,43.19 3.35,44.12 3.35,47.88 4.16,48.68 7.15,48.68 8.83,50.36 | 8.83,50.36 | 8.83,50.36 v8.85,50.35
TX  (via drill 0.35)
  Top 0.254: D18.C 27.87,62.32 28.55,61.64 31.48,61.64 v32.19,62.36 32.19,64.27 U19.2 | MD1.34 35.43,55.46 v32.19,58.69
  Bottom 0.254: v32.19,58.69 v32.19,62.36 | v32.19,62.36 32.19,62.41 32.18,62.42 32.18,62.37 v32.19,62.36
TX_PZEM
  Top 0.254: PZEM004T1.TX 57.44,19.44 45.89,30.99 45.89,45.64 43.69,47.84 MD1.28
USB_N
  Top 0.254: J2.2 36.76,73.57 35.41,72.22 29.95,72.22 28.69,70.96 28.69,69.28 31.02,66.94 36,66.94 37.25,65.7 U19.6
USB_P
  Top 0.254: J2.3 36.11,73.57 35.16,72.62 29.78,72.62 28.23,71.07 28.23,69.14 30.83,66.54 35.41,66.54 35.98,65.96 U19.5
VCC  (via drill 0.35)
  Top 0.254: R47.2 9.14,65.11 7.92,66.33 7.92,72.92 U1.3 8.96,73.96 v8.96,75.79 | v64.42,40.71 64.42,51.75 44.69,71.48 44.69,73.65 v42.83,75.51
  Bottom 0.254: D1.C | D1.C 64.42,38.47 | 64.42,38.47 v64.42,40.71 63.42,41.7 C11.2 | D2.C 63.03,35.03 63.03,36.52 63.62,37.1 D1.C | 64.42,38.47 65.11,39.16 77.11,39.16 78.27,38 78.27,27.07 77.1,25.9 73.34,25.9 68.11,20.67 54.2,20.67 52.35,18.83 PZEM004T1.5V 41.94,9.54 38.55,12.94 D3.C 11.38,10.78 7.61,10.78 R2.2 5.54,15.96 3,18.5 K2.A1 | v42.83,75.51 27.1,75.51 25.54,77.07 10.25,77.07 v8.96,75.79
VCC_USB  (via drill 0.35)
  Top 0.254: J2.1 37.41,72.91 | 37.41,72.91 36.05,71.55 31.49,71.55 30.9,70.96 U19.16 30.83,69.87 v29.84,69.87 | v60.42,39.48 60.42,53.13 41.74,71.81 38.51,71.81 37.41,72.91 | v23.12,72.17 23.94,73 C8.+
  Bottom 0.254: D2.A 60.42,38.37 v60.42,39.48 C7.2 | v29.84,69.87 23.52,69.87 22.79,70.59 22.79,71.85 v23.12,72.17
(copper drawn outside any net)
  shapes: Top area x2

### Text on the board
tNames: CT | AC | RELAY | POWER